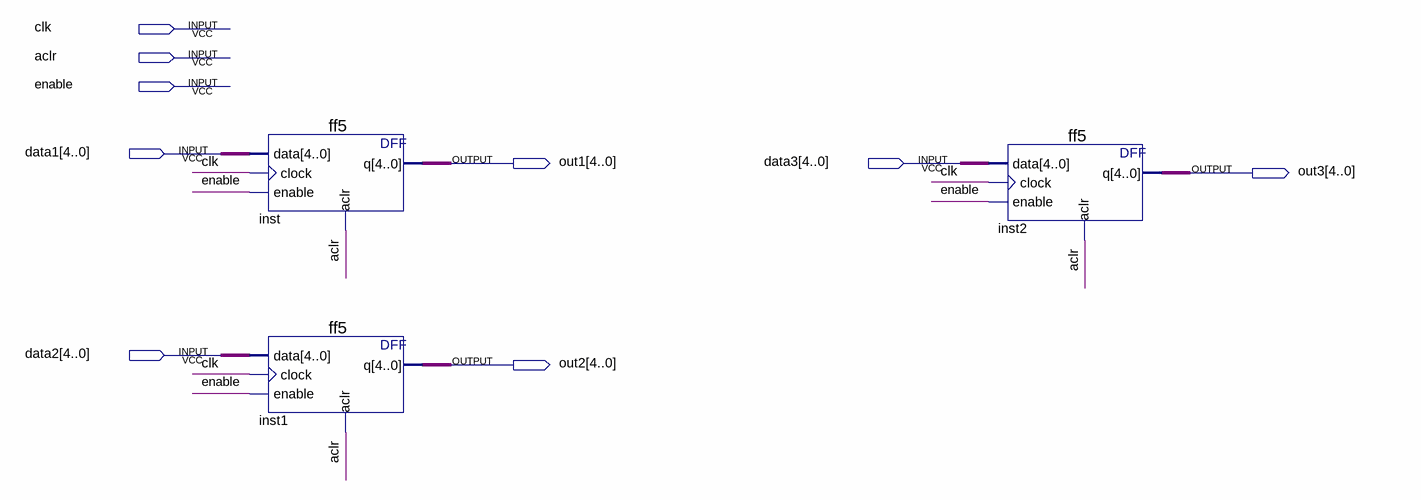
[diagram p0: schematic sheet]
// Quartus schematic buffer5.bdf as structural Verilog: 3 symbols, 9 pins
module buffer5 (
  input  clk,
  input  aclr,
  input  enable,
  input  [4:0] data1,
  input  [4:0] data3,
  input  [4:0] data2,
  output [4:0] out1,
  output [4:0] out3,
  output [4:0] out2
);

  ff5 inst (.data(data1), .clock(clk), .enable(enable), .aclr(aclr), .q(out1));
  ff5 inst1 (.data(data2), .clock(clk), .enable(enable), .aclr(aclr), .q(out2));
  ff5 inst2 (.data(data3), .clock(clk), .enable(enable), .aclr(aclr), .q(out3));
endmodule
